# Altium schematic sheet Power2.SchDoc: Power
size A; Author: Tim Jager; DrawnBy: Tim Jager; Engineer: Tim Jager
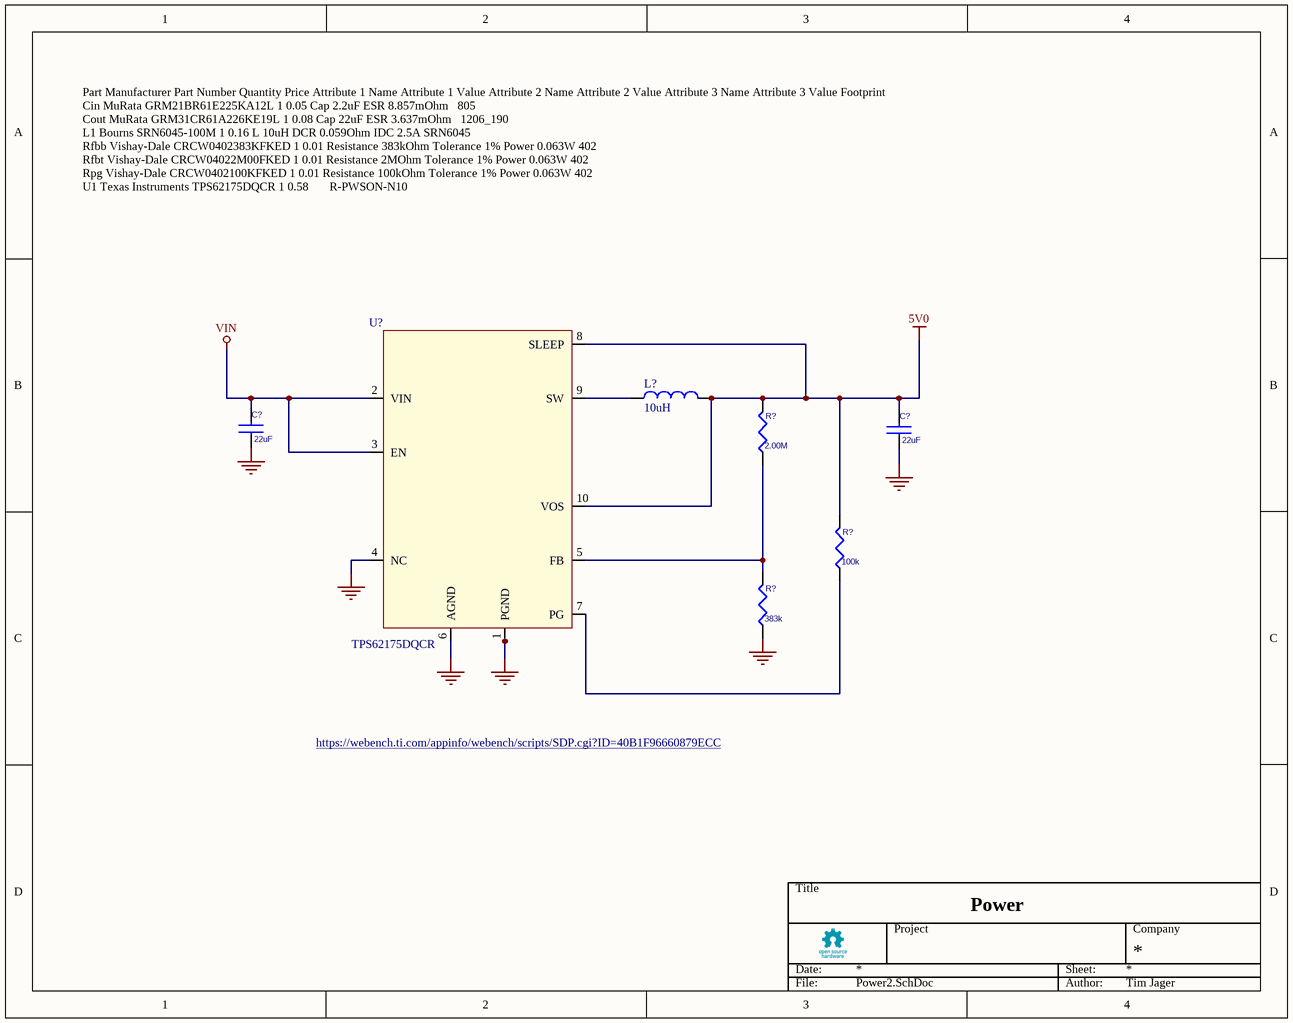
[diagram p0: Power2.SchDoc]

## Parts
(Parts that share a designator on the sheet are numbered #1, #2 ... from top to bottom, then left to right.)
C?#1  22uF  [CAPC2012L]
C?#2  22uF  [CAPC2012L]
L?  10uH  [CAPC1005L]
R?#1  2.00M  [RESC1005L]
R?#2  100k  [RESC1005L]
R?#3  383k  [RESC1005L]
U?  TPS62175DQCR  [R-PWSON-N10]

## Nets
5V0: C?#2.2 L?.2 R?#1.2 R?#2.2 U?.8(SLEEP) U?.10(VOS)
GND: C?#1.1 C?#2.1 R?#3.1 U?.1(PGND) U?.4(NC) U?.6(AGND) U?.11(PGND)
VIN: C?#1.2 U?.2(VIN) U?.3(EN)
NetL?_1: L?.1 U?.9(SW)
NetR?#1_1: R?#1.1 R?#3.2 U?.5(FB)
NetR?#2_1: R?#2.1 U?.7(PG)

## Notes on the sheet
- Part	Manufacturer	Part Number	Quantity	Price	Attribute 1 Name	Attribute 1 Value	Attribute 2 Name	Attribute 2 Value	Attribute 3 Name	Attribute 3 Value	Footprint
  Cin	MuRata	GRM21BR61E225KA12L	1	0.05	Cap	2.2uF	ESR	8.857mOhm			805
  Cout	MuRata	GRM31CR61A226KE19L	1	0.08	Cap	22uF	ESR	3.637mOhm			1206_190
  L1	Bourns	SRN6045-100M	1	0.16	L	10uH	DCR	0.059Ohm	IDC	2.5A	SRN6045
  Rfbb	Vishay-Dale	CRCW0402383KFKED	1	0.01	Resistance	383kOhm	Tolerance	1%	Power	0.063W	402
  Rfbt	Vishay-Dale	CRCW04022M00FKED	1	0.01	Resistance	2MOhm	Tolerance	1%	Power	0.063W	402
  Rpg	Vishay-Dale	CRCW0402100KFKED	1	0.01	Resistance	100kOhm	Tolerance	1%	Power	0.063W	402
  U1	Texas Instruments	TPS62175DQCR	1	0.58							R-PWSON-N10
- https://webench.ti.com/appinfo/webench/scripts/SDP.cgi?ID=40B1F96660879ECC
- Title
- Date:
- Project
- Sheet:
- Company
- File:
- Author:

## Library data of the parts
C?#1 C?#2 = CAP NP_1_Dup1
L? = Inductor: LPS4018-103MRB 10uH 0.18 Ohm 1.25A; Supplier 1: Mouser; Supplier Part Number 1: 994-LPS4018-103MRB
R?#1 R?#2 = RES: Resistor 5%
R?#3 = RES: Resistor 1%
U? = TPS62175DQCR: Imported; Supplier 1: Digi-Key; Supplier Part Number 1: 296-39451-1-ND